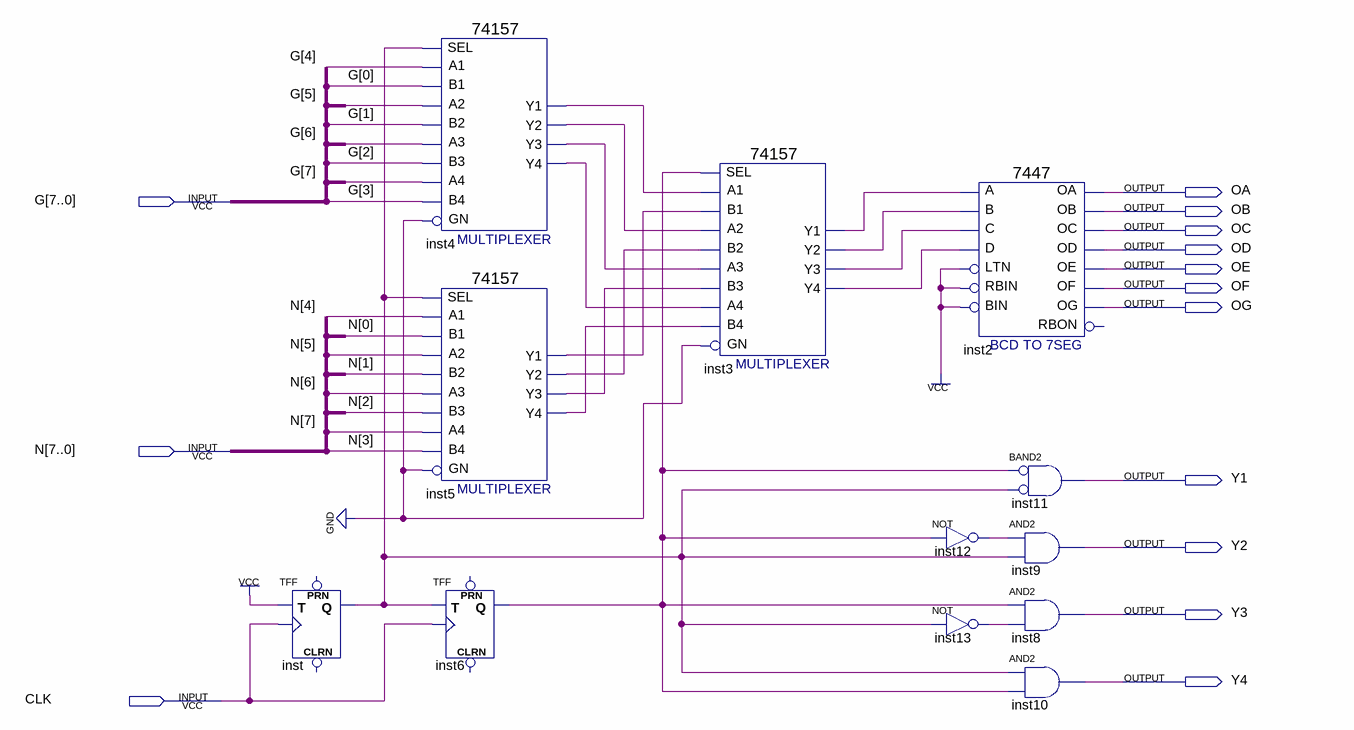
[diagram p0: schematic sheet]
// Quartus schematic display.bdf as structural Verilog: 12 symbols, 14 pins
module display (
  input  [7:0] G,
  input  [7:0] N,
  input  CLK,
  output OA,
  output OB,
  output OC,
  output OD,
  output OE,
  output OF,
  output OG,
  output Y1,
  output Y2,
  output Y3,
  output Y4
);

  wire inst3_y1, inst3_y2, inst3_y3, inst3_y4, inst4_y1, inst4_y2, inst4_y3, inst4_y4, inst5_y1, inst5_y2,
       inst5_y3, inst5_y4, inst6_q, inst12_out, inst13_out, inst_q;

  TFF inst (.T(1'b1), .CLK(CLK), .Q(inst_q));  // open: PRN, CLRN
  \74157  inst4 (
    .A1(G[4]), .B1(G[0]), .SEL(inst_q), .B2(G[1]), .A3(G[6]), .B3(G[2]), .A2(G[5]), .B4(G[3]), .GN(1'b0),
    .A4(G[7]), .Y2(inst4_y2), .Y1(inst4_y1), .Y4(inst4_y4), .Y3(inst4_y3));
  \74157  inst5 (
    .A1(N[4]), .B1(N[0]), .SEL(inst_q), .B2(N[1]), .A3(N[6]), .B3(N[2]), .A2(N[5]), .B4(N[3]), .GN(1'b0),
    .A4(N[7]), .Y2(inst5_y2), .Y1(inst5_y1), .Y4(inst5_y4), .Y3(inst5_y3));
  TFF inst6 (.T(inst_q), .CLK(CLK), .Q(inst6_q));  // open: PRN, CLRN
  \74157  inst3 (
    .A1(inst4_y1), .B1(inst5_y1), .SEL(inst6_q), .B2(inst5_y2), .A3(inst4_y3), .B3(inst5_y3), .A2(inst4_y2),
    .B4(inst5_y4), .GN(1'b0), .A4(inst4_y4), .Y2(inst3_y2), .Y1(inst3_y1), .Y4(inst3_y4), .Y3(inst3_y3));
  \7447  inst2 (
    .LTN(1'b1), .B(inst3_y2), .C(inst3_y3), .D(inst3_y4), .RBIN(1'b1), .BIN(1'b1), .A(inst3_y1), .OB(OB),
    .OC(OC), .OE(OE), .OD(OD), .OF(OF), .OG(OG), .OA(OA));  // open: RBON
  not inst12 (inst12_out, inst6_q);
  not inst13 (inst13_out, inst_q);
  and inst11 (Y1, ~inst6_q, ~inst_q);  // BAND2
  and inst9 (Y2, inst12_out, inst_q);
  and inst8 (Y3, inst6_q, inst13_out);
  and inst10 (Y4, inst_q, inst6_q);
endmodule
